# Altium project Altium.PrjPcb
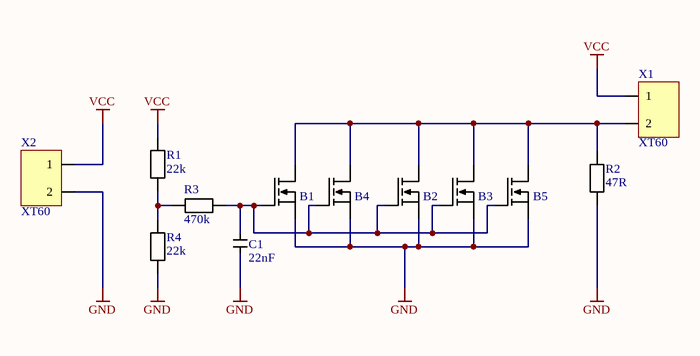
[diagram p0: Schema.SchDoc]
1 sheet, 12 parts. Net scope: global (net labels, ports and power ports of the same name join across sheets).
Board file: PCB.PcbDoc

## Sheet Schema.SchDoc
size A4; SheetNumber: 1; SheetTotal: 1

### Parts
B1  N Kanal FET  [PowerPak SO-8]  (value not drawn)
B2  N Kanal FET  [PowerPak SO-8]  (value not drawn)
B3  N Kanal FET  [PowerPak SO-8]  (value not drawn)
B4  N Kanal FET  [PowerPak SO-8]  (value not drawn)
B5  N Kanal FET  [PowerPak SO-8]  (value not drawn)
C1  value 22nF  [CAP CER 0805 H]  (hidden comment: Capacitor 0805)
R1  value 22k  [RES 0805 H]  (hidden comment: Resistor 0805)
R2  value 47R  [DPAK Schottky]  (hidden comment: Resistor 2512)
R3  value 470k  [RES 0805 H]  (hidden comment: Resistor 0805)
R4  value 22k  [RES 0805 H]  (hidden comment: Resistor 0805)
X1  XT60  [XT60_THT Male]
X2  XT60  [XT60_THT Male]

### Nets
GND: B1.2(Source) B2.2(Source) B3.2(Source) B4.2(Source) B5.2(Source) C1.1 R2.1 R4.2 X2.2
VCC: R1.1 X1.1 X2.1
NetB1_1: B1.1(Gate) B2.1(Gate) B3.1(Gate) B4.1(Gate) B5.1(Gate) C1.2 R3.2
NetB1_3: B1.3(Drain) B2.3(Drain) B3.3(Drain) B4.3(Drain) B5.3(Drain) R2.2 X1.2
NetR1_2: R1.2 R3.1 R4.1